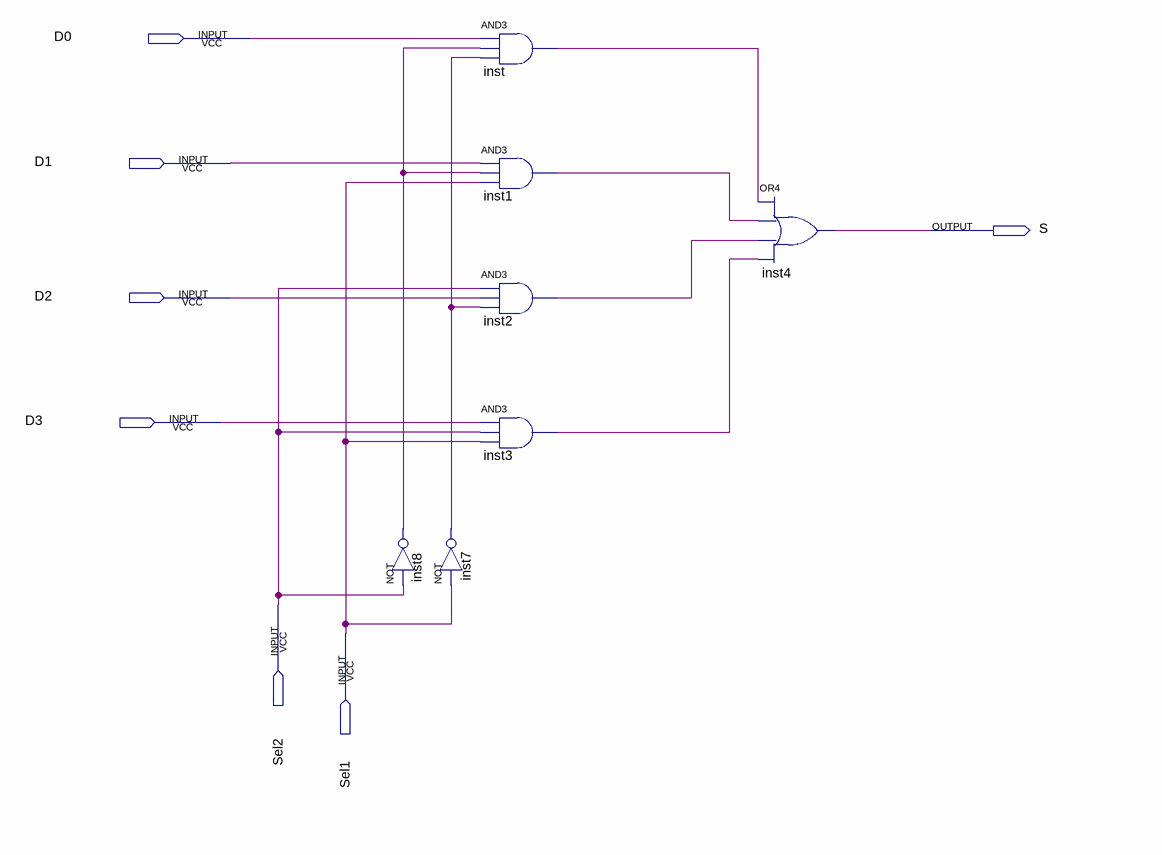
[diagram p0: schematic sheet]
// Quartus schematic mux4.bdf as structural Verilog: 7 symbols, 7 pins
module mux4 (
  input  D0,
  input  D1,
  input  D2,
  input  D3,
  input  Sel2,
  input  Sel1,
  output S
);

  wire inst1_out, inst2_out, inst3_out, inst7_out, inst8_out, inst_out;

  not inst8 (inst8_out, Sel2);
  not inst7 (inst7_out, Sel1);
  and inst (inst_out, D0, inst8_out, inst7_out);
  and inst1 (inst1_out, D1, inst8_out, Sel1);
  and inst2 (inst2_out, Sel2, D2, inst7_out);
  and inst3 (inst3_out, D3, Sel2, Sel1);
  or inst4 (S, inst_out, inst1_out, inst2_out, inst3_out);
endmodule
